# Altium project 4_TPS63060降压--升压转换器.PrjPcb
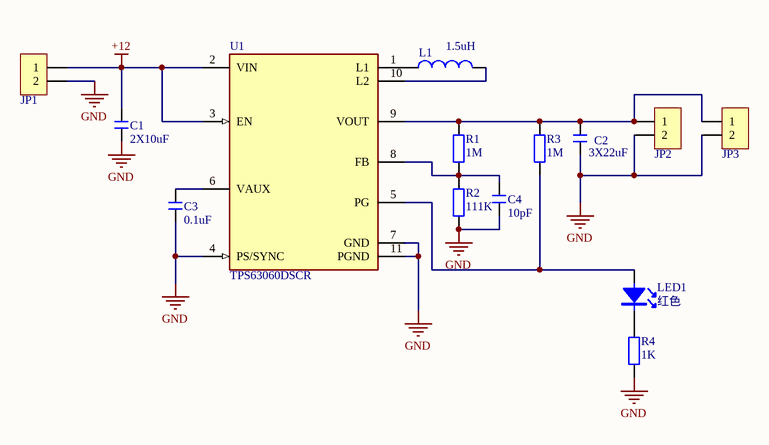
[diagram p0: 4_TPS63060降压--升压转换器.SchDoc]
1 sheet, 14 parts. Net scope: global (net labels, ports and power ports of the same name join across sheets).
Board file: 4_TPS63060降压--升压转换器.PcbDoc

## Sheet 4_TPS63060降压--升压转换器.SchDoc
size A4; SheetNumber: 1; SheetTotal: 1

### Parts
C1  2X10uF  [C 0805_L]
C2  3X22uF  [C 0805_L]
C3  0.1uF  [C 0805_L]
C4  10pF  [C 0805_L]
JP1  HDR-1X2  [KF2EDGK5.08-WI-2P]  (value not drawn)
JP2  HDR-1X2  [HDR2.54-WI-2P]  (value not drawn)
JP3  HDR-1X2  [HDR2.54-WI-2P]  (value not drawn)
L1  1.5uH  [L 0805]
LED1  红色  [LED 0805G]
R1  1M  [R 0805_L]
R2  111K  [R 0805_L]
R3  1M  [R 0805_L]
R4  1K  [R 0805_L]
U1  TPS63060DSCR  [FP-DSC0010G-MFG]

### Nets
+12: C1.2 JP1.1 U1.2(VIN) U1.3(EN)
GND: C1.1 C2.1 C3.1 C4.1 JP1.2 JP2.2 JP3.2 R2.1 R4.1 U1.4(PS/SYNC) U1.7(GND) U1.11(PGND)
NetC2_2: C2.2 JP2.1 JP3.1 R1.2 R3.2 U1.9(VOUT)
NetC3_2: C3.2 U1.6(VAUX)
NetC4_2: C4.2 R1.1 R2.2 U1.8(FB)
NetL1_1: L1.1 U1.1(L1)
NetL1_2: L1.2 U1.10(L2)
NetLED1_1: LED1.1(A) R3.1 U1.5(PG)
NetLED1_2: LED1.2(K) R4.2

### Library data of the parts
C1-C4 = C: 贴片电容; 淘宝ID: 小糖豆的小窝窝; BOM名称: 贴片电容; 下单链接: https://item.taobao.com/item.htm?ft=t&id=613637044352
JP1-JP3 = Header 2: 2P接插件; 淘宝ID: 小糖豆的小窝窝; BOM名称: 2P接插件; 下单链接: https://item.taobao.com/item.htm?ft=t&id=613637044352
L1 = L: 小功率贴片电感; BOM名称: 小功率贴片电感; 下单链接: https://item.taobao.com/item.htm?ft=t&id=613637044352
LED1 = LED-SMD: 贴片LED; 淘宝ID: 小糖豆的小窝窝; BOM名称: 贴片LED; 下单链接: https://item.taobao.com/item.htm?ft=t&id=613637044352
R1-R4 = R: 贴片电阻; 淘宝ID: 小糖豆的小窝窝; BOM名称: 贴片电阻; 下单链接: https://item.taobao.com/item.htm?ft=t&id=613637044352
U1 = CMP-04918-000043-1: IC REG BCK BST ADJ 2A 10WSON; Manufacturer: Texas Instruments; Standoff Height: 0mm; Switching Frequency: 2400kHz; Min Supply Voltage: 2.5V; Number Of Outputs: 1; Output Voltage: 2.5-8V; Max Junction Temp: +125°C; Nominal Supply Current: 30uA; Output Type: AdjustableProgrammable; Output Current: 1A; Max Supply Voltage: 12V; Max Duty Cycle: 100%; Switching Topology: Buck-Boost; Octopart: https://octopart.com/tps63060dscr-texas+instruments-21396306; ComponentLink2Description: Datasheet; Category: IC; Ambient Temperature Range High: +85°C; Ipc Land Pattern Name: DFN300X300X70-10; Automotive: No; Manufacturer Part Number: TPS63060DSCR; Mouser Description: Voltage Regulators - Switching Regulators 2.5-12Vin,2.25A Sw Crnt Limit; Lead Free: Yes; Digikey Description: IC REG BCK BST ADJ 2A 10WSON; Device Class L3: Voltage Regulators - Switching; Ambient Temperature Range Low: -40°C; Temperature: -40°C to +85°C; Package: DSC0010G; Device Class L2: Power Management ICs; Device Class L1: Integrated Circuits (ICs); ComponentLink2URL: http://www.ti.com/lit/ds/symlink/tps63060.pdf; Temperature Range High: +85°C; Height: 0.8mm; RoHS: TRUE; Temperature Range Low: -40°C